# EAGLE design Encoder (EAGLE 6.4)
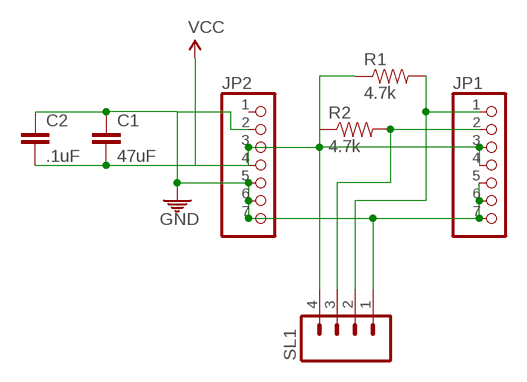
[diagram p0: schematic, sheet 1]

## Parts
C1  47uF  CAP0805  [0805]
C2  .1uF  CAP0805  [0805]
JP1  PINHD-1X7  [1X07]
JP2  PINHD-1X7  [1X07]
R1  4.7k  RESISTOR0805-RES  [0805]
R2  4.7k  RESISTOR0805-RES  [0805]
SL1  M04LOCK  [1X04_LOCK]

## Nets
GND: C1.1 C2.1 JP1.5 JP1.6 JP1.7 JP2.2 JP2.5 JP2.6 JP2.7 SL1.1
N$1: JP1.1 R1.2 SL1.2
N$2: JP1.2 R2.2 SL1.3
VCC: C1.2 C2.2 JP1.3 JP1.4 JP2.3 JP2.4 R1.1 R2.1 SL1.4
Unconnected: JP2.1

## Library data of the parts
C1 C2 = ASL:CAP: Capacitor Standard 0603 ceramic capacitor, and 0.1" leaded capacitor.
JP1 JP2 = baro:PINHD-1X7: PIN HEADER
R1 R2 = ASL:RESISTOR: Resistor Basic schematic elements and footprints for 0603, 1206, and PTH resistors.
SL1 = ASL:M04: AMP QUICK CONNECTOR

## Board
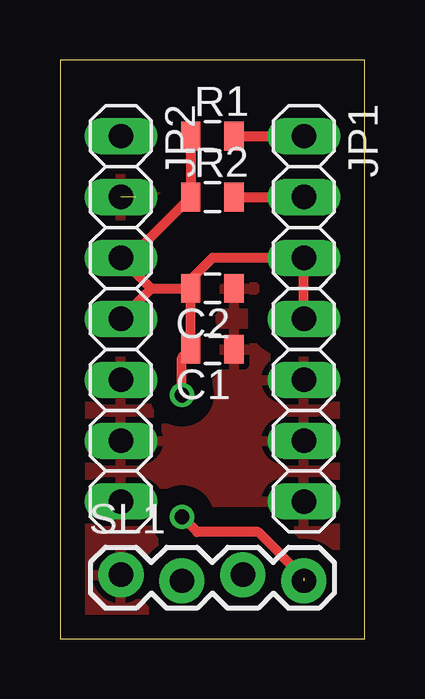
[diagram p1: board, top side]
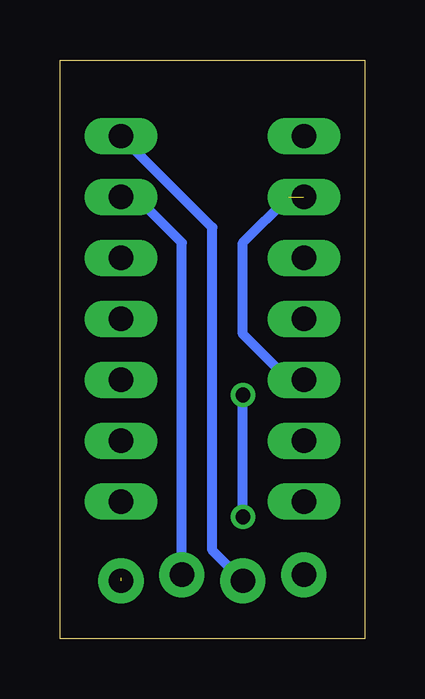
[diagram p2: board, bottom side, seen from below]

Size 12.7 x 24.13 mm. Coordinates in mm from the lower left corner, seen from the top.
Outline: 0,0 12.7,0 12.7,24.13 0,24.13 0,0
Copper layers (1*16): Top 0.035mm / dielectric 1.5mm / Bottom 0.035mm
Design rules "default": minimum track width 10mil, minimum drill 24mil, track to track 8mil, track to pad 8mil, pad to pad 8mil, via to via 8mil, smd to smd 8mil, copper to edge 40mil, drill to drill 8mil, minimum pad ring 10mil, minimum via ring 8mil, stop-mask expansion 4mil, vias tented up to drill 0mil, thermal gap 10mil

### Footprints (pad centres in the part's own frame; a part is rotated, then mirrored left to right if it is on the bottom)
0805 = smd 0.8 x 1.2: 1 -0.9,0; 2 0.9,0
1X07 = drill 1.016 long: 1 -7.62,0; 2 -5.08,0; 3 -2.54,0; 4 0,0; 5 2.54,0; 6 5.08,0; 7 7.62,0
1X04_LOCK = drill 1.016 pad 1.88: 1 0,0.127; 2 2.54,-0.127; 3 5.08,0.127; 4 7.62,-0.127

### Placement (x,y rotation side)
C1  6.35,12.07 180 top
C2  6.35,14.61 180 top
JP1  10.16,13.34 270 top
JP2  2.54,13.34 270 top
R1  6.35,20.96 0 top
R2  6.35,18.41 0 top
SL1  2.54,2.54 0 top

### Tracks (layer width: path | path; a pad name or v marks a point on that pad's centre or on a via)
GND  (1 unrouted)
  Bottom 0.406: JP2.5 3.17,10.79 5.08,12.7 5.08,16.51 3.17,18.41
  pour Top (isolate 0.813): 0,0 12.7,0 12.7,24.13 0,24.13
N$1
  Top 0.406: R1.2 JP1.1
  Bottom 0.406: JP1.1 6.35,17.14 6.35,3.68 SL1.2
N$2
  Top 0.406: R2.2 JP1.2
  Bottom 0.406: JP1.2 9.53,18.41 7.62,16.51 SL1.3
VCC  (via drill 0.61)  (1 unrouted)
  Top 0.406: C2.2 C1.2 5.08,11.7 v5.08,10.16 | 3.81,14.61 C2.2 | 10.16,2.54 8.26,4.45 5.71,4.45 v5.08,5.08 | R1.1 R2.1 2.91,15.88 JP2.3 3.81,14.61 | JP2.4 3.81,14.61 | JP1.4 JP1.3 6.35,15.88 5.45,14.98 C2.2
  Bottom 0.406: v5.08,5.08 v5.08,10.16